# EAGLE schematic controller testjig (EAGLE 7.1.0)
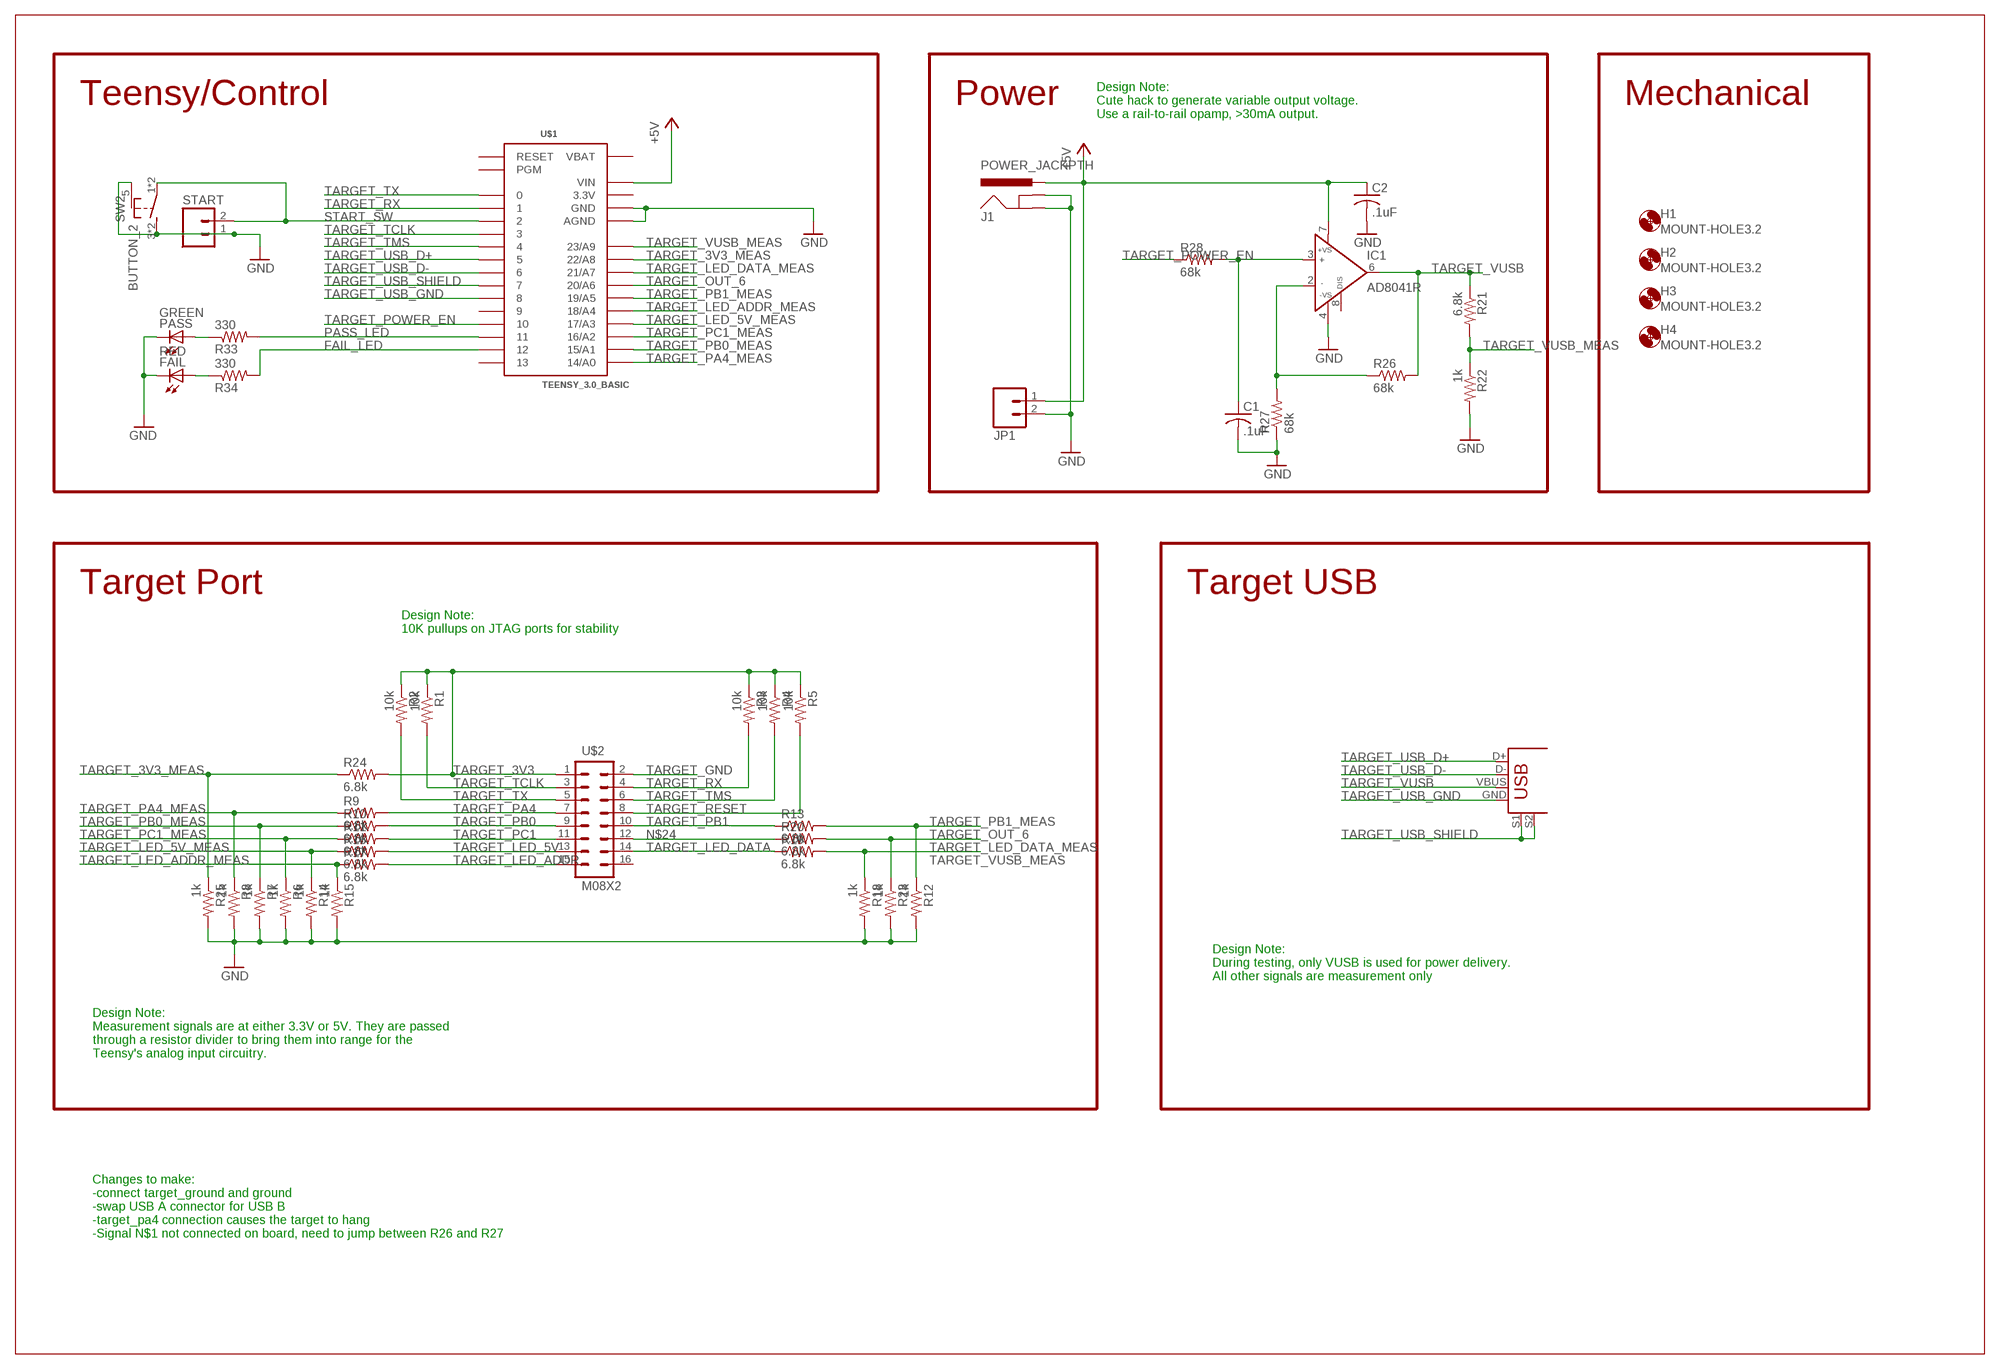
[diagram p0: schematic, sheet 1]

## Parts
C1  .1uF  C-USC0603  [C0603]
C2  .1uF  C-USC0603  [C0603]
FAIL  RED  LED5MM  [LED5MM]
H1  MOUNT-HOLE3.2  [3,2]
H2  MOUNT-HOLE3.2  [3,2]
H3  MOUNT-HOLE3.2  [3,2]
H4  MOUNT-HOLE3.2  [3,2]
IC1  AD8041R  [SO8]
J1  POWER_JACKPTH  [POWER_JACK_PTH]
JP1  M023.5MM  [SCREWTERMINAL-3.5MM-2]
PASS  GREEN  LED5MM  [LED5MM]
R1  10k  R-US_R0603  [R0603]
R2  10k  R-US_R0603  [R0603]
R3  10k  R-US_R0603  [R0603]
R4  10k  R-US_R0603  [R0603]
R5  10k  R-US_R0603  [R0603]
R6  1k  R-US_R0603  [R0603]
R7  1k  R-US_R0603  [R0603]
R8  1k  R-US_R0603  [R0603]
R9  6.8k  R-US_R0603  [R0603]
R10  6.8k  R-US_R0603  [R0603]
R11  6.8k  R-US_R0603  [R0603]
R12  1k  R-US_R0603  [R0603]
R13  6.8k  R-US_R0603  [R0603]
R14  1k  R-US_R0603  [R0603]
R15  1k  R-US_R0603  [R0603]
R16  6.8k  R-US_R0603  [R0603]
R17  6.8k  R-US_R0603  [R0603]
R18  1k  R-US_R0603  [R0603]
R19  6.8k  R-US_R0603  [R0603]
R20  6.8k  R-US_R0603  [R0603]
R21  6.8k  R-US_R0603  [R0603]
R22  1k  R-US_R0603  [R0603]
R23  1k  R-US_R0603  [R0603]
R24  6.8k  R-US_R0603  [R0603]
R25  1k  R-US_R0603  [R0603]
R26  68k  R-US_R0603  [R0603]
R27  68k  R-US_R0603  [R0603]
R28  68k  R-US_R0603  [R0603]
R33  330  R-US_R0603  [R0603]
R34  330  R-US_R0603  [R0603]
START  M02  [02P]
SW2  BUTTON_2  BUTTON_MOMENTARY_GROUND  [TD-07XB]
U$1  TEENSY_3.0_BASIC  [TEENSY_3.0_BASIC]
U$2  M08X2  [2X8]
U$3  USB+SHIELD  [USB-B-PTH]

## Nets
+5V: C2.1 IC1.7(+VS) J1.PWR JP1.1 U$1.VIN
FAIL_LED: R34.2 U$1.12
GND: C1.2 C2.2 FAIL.K(C) IC1.4(-VS) J1.GND J1.GNDBREAK JP1.2 PASS.K(C) R6.2 R7.2 R8.2 R12.2 R14.2 R15.2 R18.2 R22.2 R23.2 R25.2 R27.1 START.1 SW2.3(S) SW2.4(S) SW2.5(SHIELD) U$1.AGND U$1.GND U$1.GND1(GND)
GOOD: PASS.A R33.1
N$1: IC1.2(IN-) R26.1 R27.2
N$3: C1.1 IC1.3(IN+) R28.2
N$24: R20.1 U$2.12
N$52: FAIL.A R34.1
PASS_LED: R33.2 U$1.11
START_SW: START.2 SW2.1(P) SW2.2(P) U$1.2
TARGET_3V3: R1.1 R2.1 R3.1 R4.1 R5.1 R24.2 U$2.1
TARGET_3V3_MEAS: R24.1 R25.1 U$1.22/A8
TARGET_GND: U$2.2
TARGET_LED_5V: R16.2 U$2.13
TARGET_LED_5V_MEAS: R14.1 R16.1 U$1.17/A3
TARGET_LED_ADDR: R17.2 U$2.15
TARGET_LED_ADDR_MEAS: R15.1 R17.1 U$1.18/A4
TARGET_LED_DATA: R19.1 U$2.14
TARGET_LED_DATA_MEAS: R18.1 R19.2 U$1.21/A7
TARGET_OUT_6: R20.2 R23.1 U$1.20/A6
TARGET_PA4: R9.2 U$2.7
TARGET_PA4_MEAS: R8.1 R9.1 U$1.14/A0
TARGET_PB0: R10.2 U$2.9
TARGET_PB0_MEAS: R7.1 R10.1 U$1.15/A1
TARGET_PB1: R13.1 U$2.10
TARGET_PB1_MEAS: R12.1 R13.2 U$1.19/A5
TARGET_PC1: R11.2 U$2.11
TARGET_PC1_MEAS: R6.1 R11.1 U$1.16/A2
TARGET_POWER_EN: R28.1 U$1.10
TARGET_RESET: R5.2 U$2.8
TARGET_RX: R3.2 U$1.1 U$2.4
TARGET_TCLK: R1.2 U$1.3 U$2.3
TARGET_TMS: R4.2 U$1.4 U$2.6
TARGET_TX: R2.2 U$1.0 U$2.5
TARGET_USB_D+: U$1.5 U$3.D+
TARGET_USB_D-: U$1.6 U$3.D-
TARGET_USB_GND: U$1.8 U$3.GND
TARGET_USB_SHIELD: U$1.7 U$3.S1 U$3.S2
TARGET_VUSB: IC1.6(OUT) R21.1 R26.2 U$3.VBUS
TARGET_VUSB_MEAS: R21.2 R22.1 U$1.23/A9
Unconnected: IC1.8(DISABLE) U$1.9 U$1.13 U$1.PGM U$1.RESET U$2.16

## Notes on the sheet
- Teensy/Control | Power | Mechanical
- Design Note:
  Cute hack to generate variable output voltage.
  Use a rail-to-rail opamp, >30mA output.
- Target Port | Target USB
- Design Note:
  10K pullups on JTAG ports for stability
- Design Note:
  During testing, only VUSB is used for power delivery.
  All other signals are measurement only
- Design Note:
  Measurement signals are at either 3.3V or 5V. They are passed
  through a resistor divider to bring them into range for the
  Teensy's analog input circuitry.
- Changes to make:
  -connect target_ground and ground
  -swap USB A connector for USB B
  -target_pa4 connection causes the target to hang
  -Signal N$1 not connected on board, need to jump between R26 and R27

## Power pins joined to a net without a drawn wire
3.3V: U$1.3.3V U$1.3.3V1(3.3V)
VBAT: U$1.VBAT

## Library data of the parts
C1 C2 = adafruit:C-US: CAPACITOR, American symbol
FAIL PASS = adafruit:LED: LED OSRAM: - CHIPLED LG R971, LG N971, LY N971, LG Q971, LY Q971, LO R971, LY R971 LH N974, LH R974 LS Q976, LO Q976, LY Q976 LO Q996 - Hyper CHIPLED LW Q18S LB Q993, LB Q99A, LB R99A - SideLED LS A670, LO A670, LY A670, LG A670, LP A670 LB A673, LV A673, LT A673, LW A673 LH A674 LY A675 LS A676, LA A676, LO A676, LY A676, LW A676 LS A679, LY A679, LG A679 - Hyper Micro SIDELED® LS Y876, LA Y876, LO Y876, LY Y876 LT Y87S - SmartLED LW L88C, LW L88S LB L89C, LB L89S, LG L890 LS L89K, LO L89K, LY L89K LS L896, LA L896, LO L896, LY L896 - TOPLED LS T670, LO T670, LY T670, LG T670, LP T670 LSG T670, LSP T670, LSY T670, LOP T670, LYG T670 LG T671, LOG T671, LSG T671 LB T673, LV T673, LT T673, LW T673 LH T674 LS T676, LA T676, LO T676, LY T676, LB T676, LH T676, LSB T676, LW T676 LB T67C, LV T67C, LT T67C, LS T67K, LO T67K, LY T67K, LW E67C LS E67B, LA E67B, LO E67B, LY E67B, LB E67C, LV E67C, LT E67C LW T67C LS T679, LY T679, LG T679 LS T770, LO T770, LY T770, LG T770, LP T770 LB T773, LV T773, LT T773, LW T773 LH T774 LS E675, LA E675, LY E675, LS T675 LS T776, LA T776, LO T776, LY T776, LB T776 LHGB T686 LT T68C, LB T68C - Hyper Mini TOPLED® LB M676 - Mini TOPLED Santana® LG M470 LS M47K, LO M47K, LY M47K Source: http://www.osram.convergy.de/
H1-H4 = holes:MOUNT-HOLE: MOUNTING HOLE with drill center marker
IC1 = analog-devices:AD8041: 160 MHz Rail-to-Rail Amplifier with Disable Source: http://www.analog.com/static/imported-files/data_sheets/AD8041.pdf; MF: ALTERA CORPORATION; MPN: AD8041ARZ; OC_FARNELL: 1464831; OC_NEWARK: 88H0130
J1 = SparkFun-Connectors:POWER_JACK: Power Jack This is the standard 5.5mm barrel jack for power. The PTH is the most common, proven, reliable, footprint. The Slot footprint only works if the mill layer is transmitted to the PCB fab house so be warned. Spark Fun Electronics SKU : PRT-00119 SMT: CONN-08106 Mating wall wart : TOL-00298 (and others)
JP1 = SparkFun-Connectors:M02: Header 2 Standard 2-pin 0.1" header. Use with straight break away headers (SKU : PRT-00116), right angle break away headers (PRT-00553), swiss pins (PRT-00743), machine pins (PRT-00117), and female headers (PRT-00115). Molex polarized connector foot print use with SKU : PRT-08233 with associated crimp pins and housings.
R1-R28 R33 R34 = adafruit:R-US_: RESISTOR, American symbol
START = con-amp-quick:M02: AMP QUICK CONNECTOR; OC_FARNELL: unknown; OC_NEWARK: unknown
SW2 = blinkinlabs:BUTTON_MOMENTARY_GROUND
U$1 = Teensy3.0:TEENSY_3.0_BASIC: Basic Teensy 3.0 with none of the 'inner' pins enabled. See '+4', 'AllAnalogPins", and 'AllPins' packages for additional pin holes, as needed.
U$2 = SparkFun-Connectors:M08X2: .1" headers, two rows of 8 each
U$3 = SparkFun-Connectors:USB+SHIELD: USB+Shield USB connector with shield pins connectable